# EAGLE design dcdc_0501 (EAGLE 9.6.2)
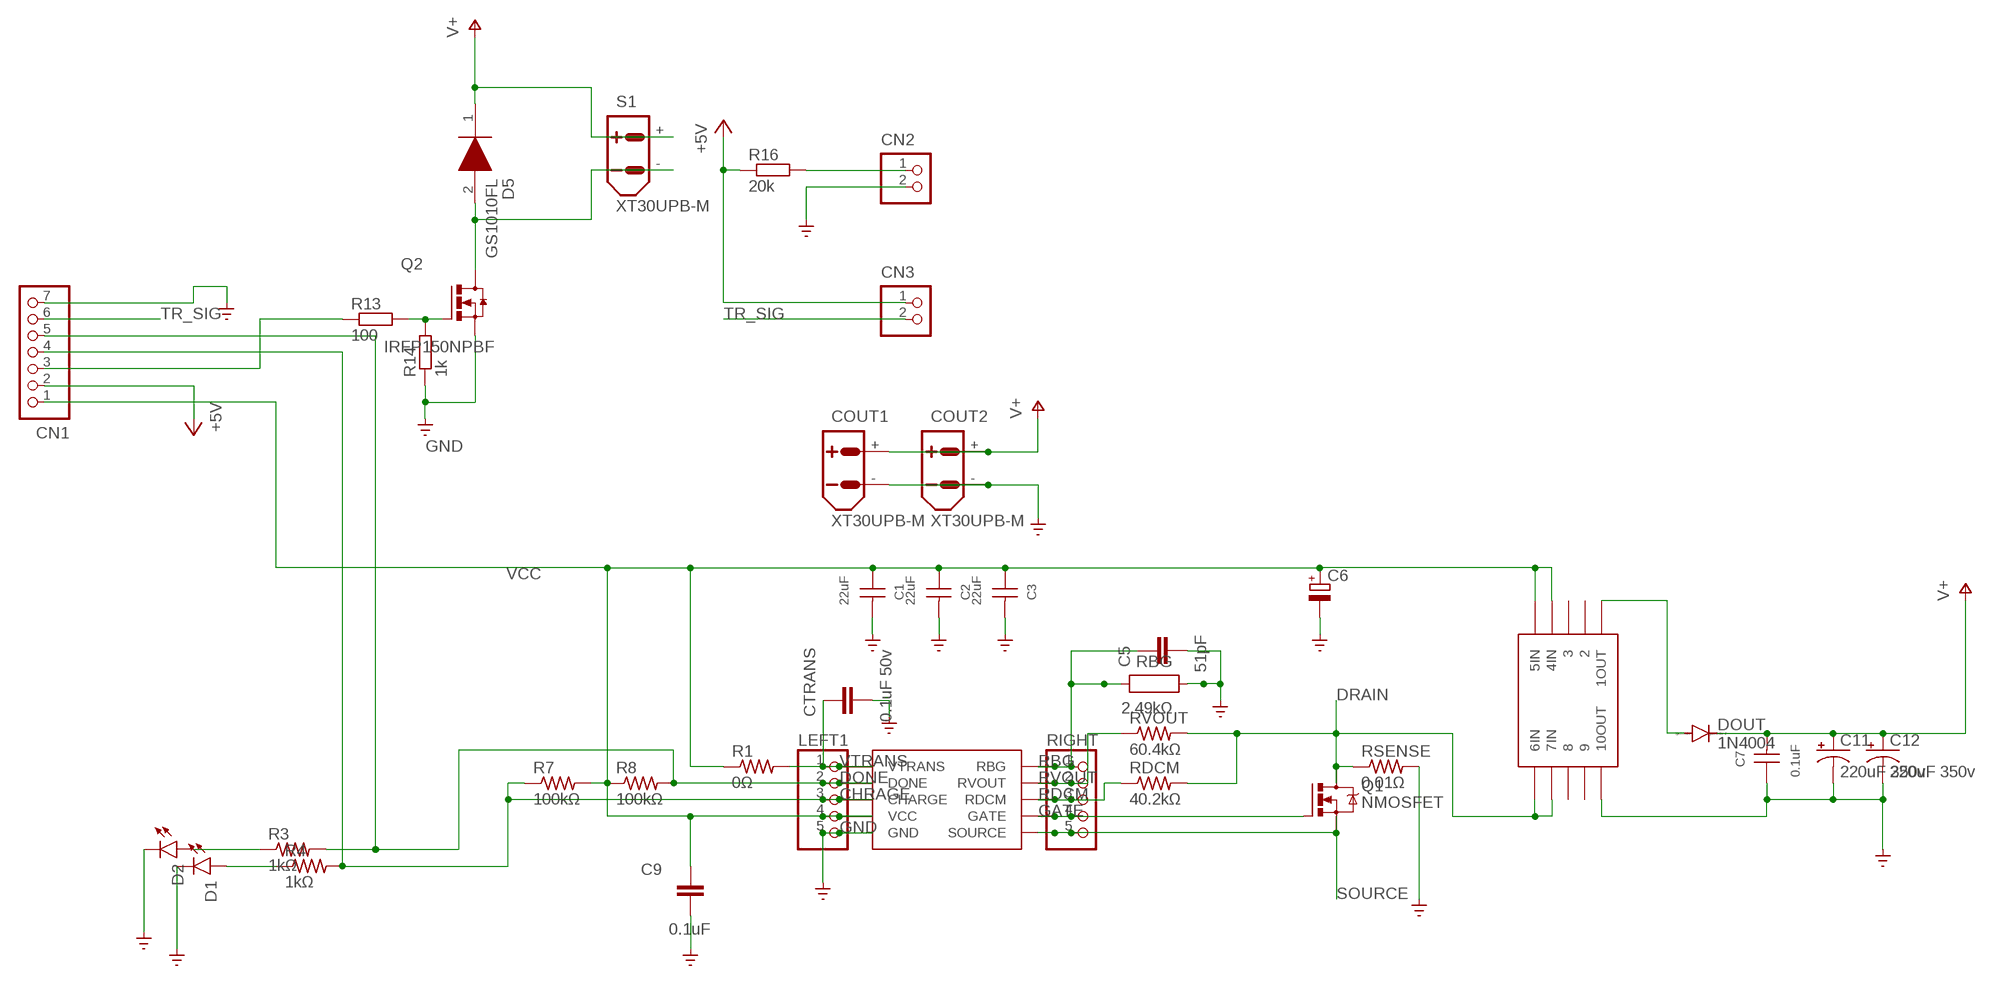
[diagram p0: schematic, sheet 1]

## Parts
C1  22uF  WCAP-CSGP_1210_H0.95_885012009002_25V(DC)  [WCAP-CSGP_1210_H0.95]
C2  22uF  WCAP-CSGP_1210_H0.95_885012009002_25V(DC)  [WCAP-CSGP_1210_H0.95]
C3  22uF  WCAP-CSGP_1210_H0.95_885012009002_25V(DC)  [WCAP-CSGP_1210_H0.95]
C5  51pF  C0603C100C5GACTU  [CAP_0603]
C6  CPOL-EUTT2D6  [TT2D6]
C7  0.1uF  WCAP-CSGP_1812_H1.25_885012010001_16V(DC)  [WCAP-CSGP_1812_H1.25]
C9  0.1uF  C0603C100C5GACTU  [CAP_0603]
C11  220uF 350v  CAPACITOR-PE7.5-18  [E7,5-18]
C12  220uF 350v  CAPACITOR-PE7.5-18  [E7,5-18]
CN1  B7B-XH-A  [B7B-XH-A]
CN2  B2B-XH-A  [B2B-XH-A]
CN3  B2B-XH-A  [B2B-XH-A]
COUT1  XT30UPB-M  [XT30UPB-M]
COUT2  XT30UPB-M  [XT30UPB-M]
CTRANS  0.1uF 50v  GRM31CR60J107ME39L  [CAP_1206]
D1  LED_RADIALWHITE  [LEDRD254W60D565H860B_W]
D2  LED_RADIALWHITE  [LEDRD254W60D565H860B_W]
D5  GS1010FL  [SODFL3618X110N]
DOUT  1N4004  [DO41-10]
LEFT1  PINHD-1X5  [1X05]
Q1  NMOSFET  NMOSFET__TO220  [TO220BV]
Q2  IRFP150NPBF  [TO-247AC]
R1  0Ω  R-US_M2012  [M2012]
R3  1kΩ  RC0402JR-070RL  [RES_0402]
R4  1kΩ  RC0402JR-070RL  [RES_0402]
R7  100kΩ  R-US_R1210  [R1210]
R8  100kΩ  R-US_R1210  [R1210]
R13  100  R-EU_R0603  [R0603]
R14  1k  R-EU_R0603  [R0603]
R16  20k  R-EU_R0603  [R0603]
RBG  2.49kΩ  WRIS-PSMC_2512_580070763005_6.3X3.1X0.51X1.1  [WRIS_PSMC_2512_6.3X3.1X0.51X1.1(LXWXHXPW)]
RDCM  40.2kΩ  CRCW08050000Z0EA  [RES_0805]
RIGHT  PINHD-1X5  [1X05]
RSENSE  0.01Ω  WSLP1206R0500FEA  [RES_1206]
RVOUT  60.4kΩ  CRCW08050000Z0EA  [RES_0805]
S1  XT30UPB-M  [XT30UPB-M]
U$1  LT3750_2  [LT3750_2]
U$2  32052  [32052]

## Nets
2 [New Class]: D5.2(A) Q2.D S1.-
+5V [New Class]: CN1.2 CN3.1 R16.1
CHRAGE: CN1.4 LEFT1.3 R4.2 R7.1 U$1.CHARGE
DONE: CN1.5 LEFT1.2 R3.2 R8.2 U$1.DONE
DRAIN [New Class]: Q1.D RDCM.2 RSENSE.1 RVOUT.2 U$2.6IN U$2.7IN
GATE: Q1.G RIGHT.4 U$1.GATE
GND: C1.2 C2.2 C3.2 C5.2 C6.- C7.1 C9.2 C11.- C12.- CN1.7 CN2.2 COUT1.- COUT2.- CTRANS.2 D1.C D2.C LEFT1.5 Q2.S R14.1 RBG.2 RSENSE.2 U$1.GND U$2.10OUT ; supply symbol labelled SUPPLY0_GND_
N$1 [New Class]: CN1.3 R13.1
N$7 [New Class]: DOUT.A U$2.1OUT
N$11 [New Class]: D1.A R4.1
N$15 [New Class]: D2.A R3.1
N$21 [New Class]: Q2.G R13.2 R14.2
N$22 [New Class]: CN2.1 R16.2
RBG: C5.1 RBG.1 RIGHT.1 U$1.RBG
RDCM: RDCM.1 RIGHT.3 U$1.RDCM
RVOUT: RIGHT.2 RVOUT.1 U$1.RVOUT
SOURCE: Q1.S RIGHT.5 U$1.SOURCE
TR_SIG [New Class]: CN1.6 CN3.2
V+ [New Class]: C7.2 C11.+ C12.+ COUT1.+ COUT2.+ D5.1(K) DOUT.C S1.+
VCC: C1.1 C2.1 C3.1 C6.+ C9.1 CN1.1 LEFT1.4 R1.1 R7.2 R8.1 U$1.VCC U$2.4IN U$2.5IN
VTRANS: CTRANS.1 LEFT1.1 R1.2 U$1.VTRANS
Unconnected: U$2.2 U$2.3 U$2.8 U$2.9

## Library data of the parts
C1-C3 = Wurth_Capacitors_WCAP-CSGP:WCAP-CSGP_1210_H0.95: WCAP-CSGP MLCCs 1210 Characteristics General purpose product series High performance ceramic High electrical precision and stability ceramic especially for NP0 Minimal aging especially for NP0 Mounting style: SMT-Chip Ceramic: NP0 (Class I), X5R (Class II), X7R (Class II) Temperature coefficient: ±30 ppm/°C; ±0.54 % for NP0 ±15 % for X5R and X7R Operating temperature: -55 °C up to + 125 °C for NP0 and X7R -55 °C up to + 85 °C for X5R Termination: Cu/Ni/Sn Recommended soldering: Reflow soldering Wave soldering for size 0603 Wave soldering for size 0805 (only valid for the thickness ≤0.85 mm) Applications Temperature compensation (NP0) Coupling Decoupling Bypass Smoothing Filtering Resonant circuit <https://www.we-online.com/catalog/media/o177837v209%20MLCC_GRP_all.jpg> Details see: https://www.we-online.com/catalog/en/pbs/capacitors/multilayer_ceramic_chip_capacitors/mlcc_general_purpose Updated by yingchun,Shan;2020-03-09 2020(C) Würth Elektronik; CERAMIC-TYPE: NP0 Class I; DATASHEET-URL: https://www.we-online.com/redexpert/spec/885012009002?ae; DF: -; HEIGHT: 0.95mm; MOUNT: SMT; OPERATING-TEMPERATURE: -55 up to +125 °C; PART-NUMBER: 885012009002; QMIN: 1000; RISO: 10GOhm; SIZE: 1210; TECHNICAL-REFERENCE: NP01210102J025DFCT10000; VALUE: 1nF; VR: 25V(DC)
C5 C9 = Resistor_Capacitor:C0603C100C5GACTU: CAP CER 10PF 50V C0G/NP0 0603 Manufacturer's datasheet <https://content.kemet.com/datasheets/KEM_C1003_C0G_SMD.pdf>; CREATED_BY: PCBLayout.com; DIGIKEY_PART_NUMBER: 399-7814-2-ND; MANUFACTURER: KEMET; MPN: C0603C100C5GACTU; PACKAGE: SMD 0603
C6 = rcl:CPOL-EU: POLARIZED CAPACITOR, European symbol; SPICEPREFIX: C
C7 = Wurth_Capacitors_WCAP-CSGP:WCAP-CSGP_1812_H1.25: WCAP-CSGP MLCCs 1812 Characteristics General purpose product series High performance ceramic High electrical precision and stability ceramic especially for NP0 Minimal aging especially for NP0 Mounting style: SMT-Chip Ceramic: NP0 (Class I), X5R (Class II), X7R (Class II) Temperature coefficient: ±30 ppm/°C; ±0.54 % for NP0 ±15 % for X5R and X7R Operating temperature: -55 °C up to + 125 °C for NP0 and X7R -55 °C up to + 85 °C for X5R Termination: Cu/Ni/Sn Recommended soldering: Reflow soldering Wave soldering for size 0603 Wave soldering for size 0805 (only valid for the thickness ≤0.85 mm) Applications Temperature compensation (NP0) Coupling Decoupling Bypass Smoothing Filtering Resonant circuit <https://www.we-online.com/catalog/media/o177837v209%20MLCC_GRP_all.jpg> Details see: https://www.we-online.com/catalog/en/pbs/capacitors/multilayer_ceramic_chip_capacitors/mlcc_general_purpose Updated by yingchun,Shan;2020-03-09 2020(C) Würth Elektronik; CERAMIC-TYPE: NP0 Class I; DATASHEET-URL: https://www.we-online.com/redexpert/spec/885012010001?ae; DF: -; HEIGHT: 1.25mm; MOUNT: SMT; OPERATING-TEMPERATURE: -55 up to +125 °C; PART-NUMBER: 885012010001; QMIN: 1000; RISO: 10GOhm; SIZE: 1812; TECHNICAL-REFERENCE: NP01812102J016DFCT10000; VALUE: 1nF; VR: 16V(DC)
C11 C12 = BeagleBone_Blue_R3:CAPACITOR-P: POLARIZED CAPACITOR, American symbol
CN1 = jst-xh:B7B-XH-A: Wire-to-Board 2.5mm pitch top mount connector Source: http://www.jst-mfg.com/product/pdf/jpn/XH.pdf http://www.jst-mfg.com/product/detail.php?series=277
CN2 CN3 = jst-xh:B2B-XH-A: Wire-to-Board 2.5mm pitch top mount connector Source: http://www.jst-mfg.com/product/pdf/jpn/XH.pdf http://www.jst-mfg.com/product/detail.php?series=277
COUT1 COUT2 S1 = amass:XT30: AMASS XT30 connector Store in Japan AMASS XT30 connector <https://szc.jp/ams-xt30>
CTRANS = Resistor_Capacitor:GRM31CR60J107ME39L: CAP CER 100UF 6.3V X5R 1206 Manufacturer's datasheet <https://www.murata.com/~/media/webrenewal/support/library/catalog/products/capacitor/mlcc/c02e.ashx?la=en-us>; CREATED_BY: PCBLayout.com; DIGIKEY_PART_NUMBER: GRM31CR60J107ME39L; MANUFACTURER: Murata Electronics North America; MPN: GRM31CR60J107ME39L; PACKAGE: SMD 1206
D1 D2 = Opto-Electronic:LED_RADIAL: LED - Generic
D5 = GS1010FL:GS1010FL: Surface general purpose rectifier Source: Datasheet; DESCRIPTION: Surface general purpose rectifier; HEIGHT: 1.1mm; MANUFACTURER_NAME: PANJIT; MANUFACTURER_PART_NUMBER: GS1010FL
DOUT = diode:1N4004: DIODE general purpose rectifier, 1 A
LEFT1 RIGHT = Connector:PINHD-1X5: PIN HEADER; CATEGORY: CONNECTOR; SUB-CATEGORY: PIN-HEADER
Q1 = Tinkercad:NMOSFET: N-Channel MOSFET - Generic; CATEGORY: Transistor; SUB-CATEGORY: MOSFET; TYPE: N-Channel
Q2 = Transistor:IRFP150NPBF: MOSFET N-CH 100V 42A TO247AC Manufacturer's datasheet <https://www.infineon.com/dgdl/irfp150npbf.pdf?fileId=5546d462533600a4015356286d121fd6>; CREATED_BY: PCBLayout.com; DIGIKEY_PART_NUMBER: IRFP150NPBF-ND; MANUFATURER: Infineon Technologies; MPN: IRFP150NPBF; PACKAGE: TO-247AC
R1 R7 R8 = BeagleBone_Black_Wireless:R-US_: RESISTOR, American symbol
R3 R4 = Resistor_Capacitor:RC0402JR-070RL: RES SMD 0 OHM JUMPER 1/16W 0402 Manufacturer's datasheet <http://www.yageo.com/documents/recent/PYu-RC_Group_51_RoHS_L_10.pdf>; CREATED_BY: PCBLayout.com; DIGIKEY_PART_NUMBER: 311-0.0JRTR-ND; MANUFACTURER: Yageo; MPN: RC0402JR-070RL; PACKAGE: SMD 0402
R13 R14 R16 = rcl:R-EU_: RESISTOR, European symbol; SPICEPREFIX: R
RBG = Wurth_Resistor_WRIS-PSMC:WRIS-PSMC_2512: WRIS-PSMC Metal Plate Resistors High Power Current Sensing Characteristics Product series for high power current sensing up to 2 W Mounting style: SMT-Chip (standard terminal) Resistance range: 2 mΩ ‒ 10 mΩ Resistance tolerance: ±1%; ±5% Rated Power: 2 W TCR: ±100 ppm/°C Operating temperature: -55°C up to +155°C Size: 2512 Recommended soldering: Reflow soldering Applications Ignition coil & igniter Motor control Inverter Battery pack Package name and Variant abbreviation: L X W X H X PW =Length X Width X Height X Pad Width <https://katalog.we-online.com/media/images/v2/o135744v209%20Family_WRIS-PSMC.jpg> Details see: https://katalog.we-online.com/en/pbs/WRIS-PSMC Created by Ella Wu 2019-09-05 2019(C) Wurth Elektronik; DATASHEET-URL: https://katalog.we-online.de/pbs/datasheet/580070763005.pdf; IR: 20A; MOUNT: SMT; PART-NUMBER: 580070763005; PRATED: 2W; TCR: ±100ppm/ °C; TECHNICAL-REFERENCE: MC2512R005F201KAATE0000; VALUE: 5mOhm
RDCM RVOUT = Resistor_Capacitor:CRCW08050000Z0EA: RES SMD 0 OHM JUMPER 1/8W 0805 Manufacturer's datasheet <http://www.vishay.com/docs/20035/dcrcwe3.pdf>; CREATED_BY: PCBLayout.com; DIGIKEY_PART_NUMBER: 541-0.0ATR-ND; MANUFACTURER: Vishay Dale; MPN: CRCW08050000Z0EA; PACKAGE: SMD 0805
RSENSE = Resistor_Capacitor:WSLP1206R0500FEA: RES 0.05 OHM 1% 1W 1206 Manufacturer's datasheet <http://www.vishay.com/docs/30122/wslp.pdf>; CREATED_BY: PCBLayout.com; DIGIKEY_PART_NUMBER: WSLP-.05TR-ND; MANUFACTURER: Vishay Dale; MPN: WSLP1206R0500FEA; PACKAGE: SMD 1206
U$1 = boostTest1215:LT3750_2
U$2 = boostTest1215:32052

## Net classes
0 default: width 0.2 mm, drill 0.1 mm
1 New Class: width 1.2 mm, clearance 0.203 mm

## Board
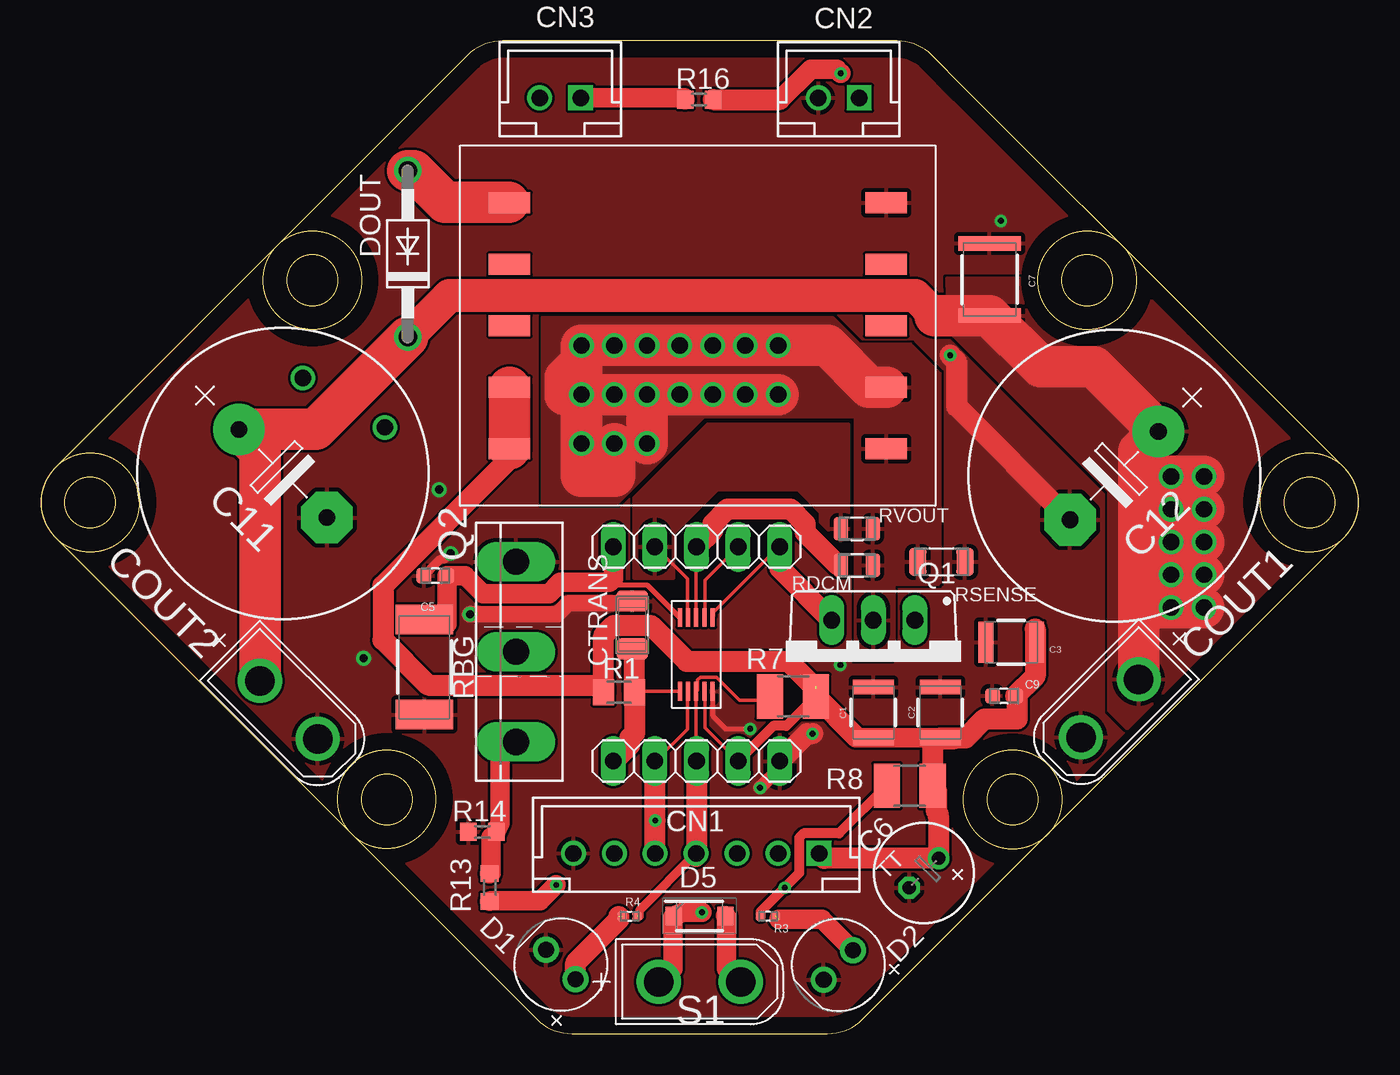
[diagram p1: board, top side]
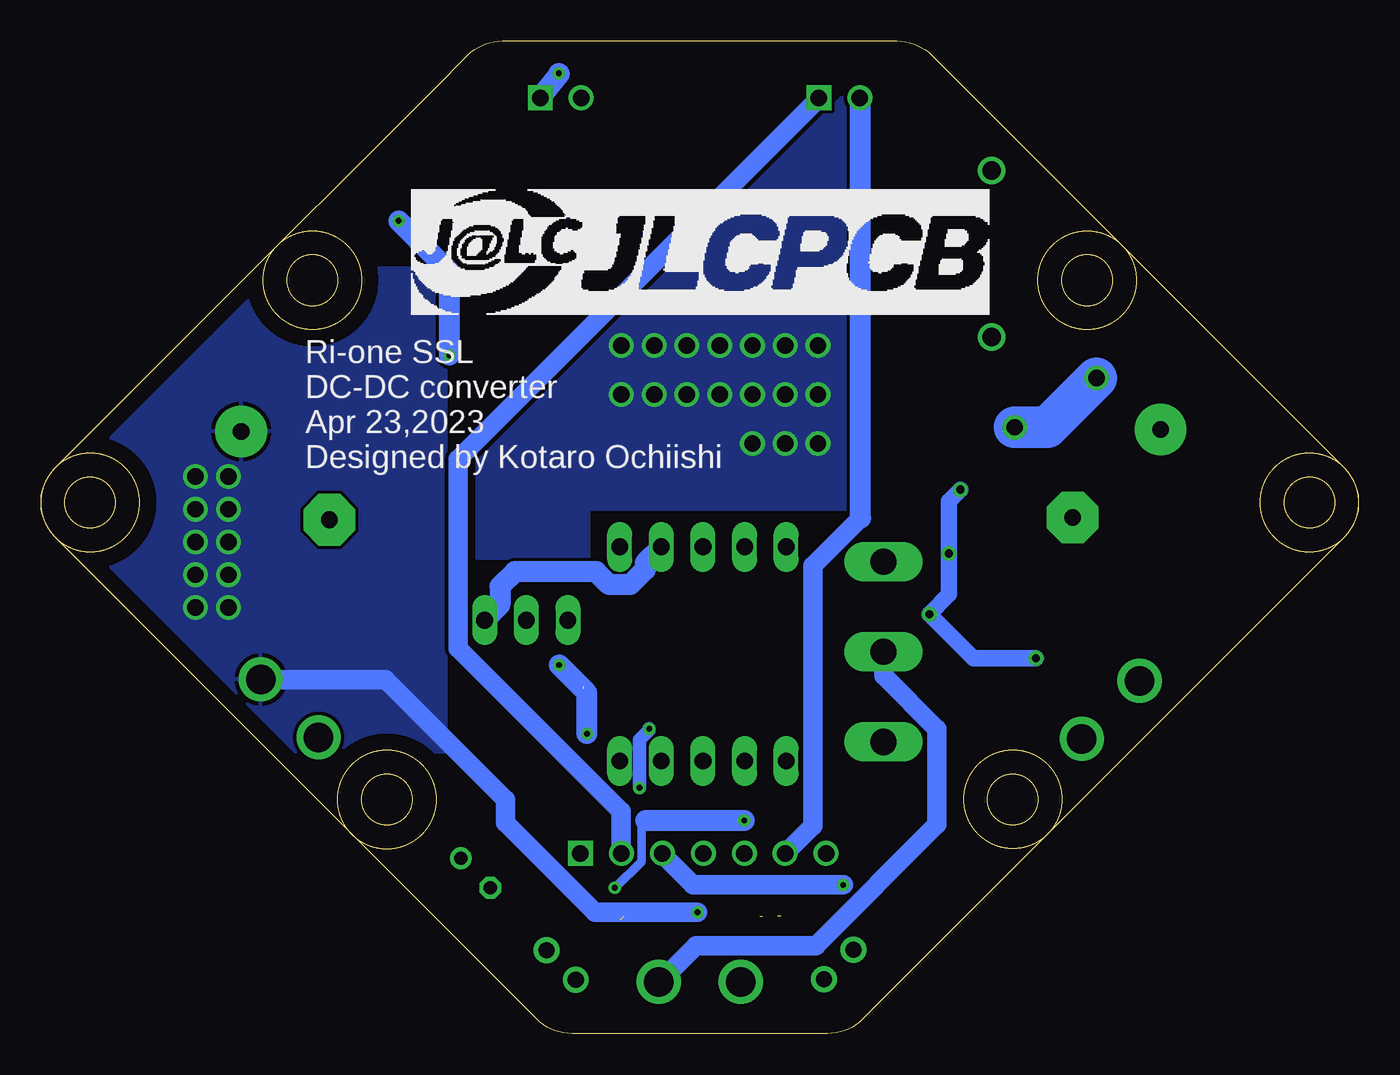
[diagram p2: board, bottom side, seen from below]

Size 80.43 x 60.58 mm. Coordinates in mm from the lower left corner, seen from the top.
Outline: 0.88,34.53 arc90 0.88,30.29
Outline: 30.29,0.88 arc45 32.41,0
Outline: 48.03,0 arc45 50.15,0.88
Outline: 79.56,30.29 arc90 79.56,34.53
Outline: 54.39,59.7 arc45 52.27,60.58
Outline: 28.17,60.58 arc45 26.05,59.7
Outline: 0.88,34.53 arc90 0.88,30.29
Outline: 0.88,30.29 17,14.16 30.29,0.88
Outline: 30.29,0.88 arc45 32.41,0
Outline: 32.41,0 48.03,0
Outline: 48.03,0 arc45 50.15,0.88
Outline: 50.15,0.88 63.43,14.16 79.56,30.29
Outline: 79.56,30.29 arc90 79.56,34.53
Outline: 79.56,34.53 70.67,43.41 56.39,57.7 54.39,59.7
Outline: 54.39,59.7 arc45 52.27,60.58
Outline: 52.27,60.58 28.17,60.58
Outline: 28.17,60.58 arc45 26.05,59.7
Outline: 26.05,59.7 0.88,34.53
Outline: circle at 3,32.41 radius 1.55
Outline: circle at 16.57,45.97 radius 3
Outline: circle at 3,32.41 radius 3
Outline: circle at 16.57,45.97 radius 1.55
Outline: circle at 21.12,14.29 radius 1.55
Outline: circle at 77.43,32.41 radius 1.55
Outline: circle at 59.32,14.29 radius 3
Outline: circle at 63.87,45.97 radius 3
Outline: circle at 77.43,32.41 radius 3
Outline: circle at 63.87,45.97 radius 1.55
Outline: circle at 59.32,14.29 radius 1.55
Outline: circle at 3,32.41 radius 1.55
Outline: circle at 16.57,45.97 radius 3
Outline: circle at 3,32.41 radius 3
Outline: circle at 16.57,45.97 radius 1.55
Outline: circle at 21.12,14.29 radius 1.55
Outline: circle at 77.43,32.41 radius 1.55
Outline: circle at 59.32,14.29 radius 3
Outline: circle at 63.87,45.97 radius 3
Outline: circle at 77.43,32.41 radius 3
Copper layers (1*16): Top 0.035mm / dielectric 1.5mm / Bottom 0.035mm
Design rules "default": minimum track width 6mil, minimum drill 0.35mm, track to track 6mil, track to pad 6mil, pad to pad 6mil, via to via 6mil, smd to smd 6mil, copper to edge 40mil, drill to drill 6mil, minimum pad ring 10mil, minimum via ring 8mil, stop-mask expansion 4mil, vias tented up to drill 0mil, thermal gap 10mil

### Footprints (pad centres in the part's own frame; a part is rotated, then mirrored left to right if it is on the bottom)
WCAP-CSGP_1210_H0.95 = smd 0.9 x 2.5: 1 -1.55,0; 2 1.55,0
CAP_0603 = smd 0.92 x 0.93: 1 -0.705,0; 2 0.705,0
TT2D6 = drill 0.813: + -1.27,0 | drill 0.813 octagon: - 1.27,0
WCAP-CSGP_1812_H1.25 = smd 0.9 x 3.8: 1 -2.2,0; 2 2.2,0
E7,5-18 = drill 1.016 pad 3.15: + -3.81,0 | drill 1.016 pad 3.15 octagon: - 3.81,0
B7B-XH-A = drill 1.016 square: 1 -7.5,0 | drill 1.016: 2 -5,0; 3 -2.5,0; 4 0,0; 5 2.5,0; 6 5,0; 7 7.5,0
B2B-XH-A = drill 1.016 square: 1 -1.25,0 | drill 1.016: 2 1.25,0
XT30UPB-M = drill 1.8: + 2.5,0; - -2.5,0
CAP_1206 = smd 1.29 x 1.91: 1 -1.46,0; 2 1.46,0
LEDRD254W60D565H860B_W = drill 0.981 pad 1.581: A -1.27,0; C 1.27,0
SODFL3618X110N = smd 1 x 1.13: 1 -1.575,0; 2 1.575,0
DO41-10 = drill 1.118: A 5.08,0; C -5.08,0
1X05 = drill 1.016 long: 1 -5.08,0; 2 -2.54,0; 3 0,0; 4 2.54,0; 5 5.08,0
TO220BV = drill 1.016 long: D 0,-2.54; G -2.54,-2.54; S 2.54,-2.54
TO-247AC = drill 1.6 long: D 0,0; G -5.5,0; S 5.5,0
M2012 = smd 1.3 x 1.6: 1 -0.95,0; 2 0.95,0
RES_0402 = smd 0.58 x 0.58: 1 -0.46,0; 2 0.46,0
R1210 = smd 1.6 x 2.7: 1 -1.4,0; 2 1.4,0
R0603 = smd 1 x 1.1: 1 -0.85,0; 2 0.85,0
WRIS_PSMC_2512_6.3X3.1X0.51X1.1(LXWXHXPW) = smd 1.8 x 3.5: 1 -2.9,0; 2 2.9,0
RES_0805 = smd 0.87 x 1.42: 1 -0.975,0; 2 0.975,0
RES_1206 = smd 1.08 x 1.68: 1 -1.445,0; 2 1.445,0
LT3750_2 = smd 1.15 x 0.25: CHARGE 0.5,1.5; DONE 0.5,2; GATE 5,1; GND 0.5,0.5; RBG 5,2.5; RDCM 5,1.5; RVOUT 5,2; SOURCE 5,0.5; VCC 0.5,1; VTRANS 0.5,2.5
32052 = smd 2.54 x 1.27: 1OUT 3,18.5; 2 3,14.75; 3 3,11; 4IN 3,7.25; 5IN 3,3.5; 6IN 26,3.5; 7IN 26,7.25; 8 26,11; 9 26,14.75; 10OUT 26,18.5

### Placement (x,y rotation side)
C1  50.81,19.6 90 top
C2  54.9,19.6 90 top
C3  59.23,23.89 180 top
C5  24.08,27.94 180 top
C6  53.9,9.8 225 top
C7  57.91,46.02 270 top
C9  58.79,20.61 180 top
C11  14.77,34.18 315 top
C12  65.52,34.05 225 top
CN1  40,11 180 top
CN2  48.7,57.1 180 top
CN3  31.7,57.1 180 top
COUT1  65.25,19.85 45 top
COUT2  15.13,19.76 135 top
CTRANS  36.1,24.94 90 top
D1  31.74,4.21 135 top
D2  48.68,4.19 225 top
D5  40.21,7.18 0 top
DOUT  22.39,47.59 90 top
LEFT1  40.02,16.63 0 top
Q1  50.81,22.69 180 top
Q2  29,23.3 90 top
R1  35.29,20.84 0 top
R3  44.39,7.16 180 top
R4  35.94,7.16 0 top
R7  45.91,20.58 0 top
R8  53.04,15.13 180 top
R13  27.4,8.92 90 top
R14  26.94,12.31 0 top
R16  40.18,57 0 top
RBG  23.41,22.36 270 top
RDCM  49.82,28.57 0 top
RIGHT  40.02,29.71 0 top
RSENSE  54.97,28.79 0 top
RVOUT  49.82,30.81 0 top
S1  40.22,3.16 180 top
U$1  41.5,20.39 90 top
U$2  25.6,32.2 0 top

### Tracks (layer width: path | path; a pad name or v marks a point on that pad's centre or on a via)
2
  Top 1.2: D5.2 41.85,7.14 41.85,3.96 42.64,3.17 S1.-
  Bottom 1.2: Q2.D 28.98,23.26 28.98,21.85 25.73,18.59 25.73,12.77 33.13,5.37 40.44,5.37 42.64,3.17 S1.-
+5V
  Top 1.2: 39.3,57.1 R16.1 | 39.3,57.1 CN3.1 | 39.3,57.1
  Bottom 1.2: CN3.1 33.16,56.89 33.16,56.86 54.97,35.05 54.97,23.52 45.02,13.57 45.02,11.01 CN1.2
CHRAGE  (1 unrouted)
  Top 0.2: 40,10.92 CN1.4 40,11.01 | LEFT1.3 40,16.65 U$1.CHARGE 40.09,20.97 40.09,21.58 40.26,21.76 41.23,21.76 42.64,20.35 44.45,20.35 R7.1
  Top 0.508: CN1.4 36.54,7.54 36.54,7.16
  Top 1.2: 40,10.76 40,10.92
  Top 1.27: LEFT1.3 40.02,11.04 40,11.01
DONE  (via drill 0.35)
  Top 0.2: U$1.DONE 39.47,20.88 39.47,18.59 37.53,16.65 LEFT1.2 | R3.2 43.93,7.19 43.96,7.22 43.96,7.19 R3.2
  Top 0.508: v45.4,8.9 43.93,7.43 R3.2
  Top 0.61: R8.2 48.73,12.22 46.55,12.22 46.28,11.95 46.28,9.8 43.93,7.45 R3.2
  Top 1.27: CN1.5 v37.5,13 37.5,16.62 37.53,16.65
  Bottom 0.508: 43.5,13 43.78,12.72 43.78,10.49 45.38,8.9 v45.4,8.9
  Bottom 1.27: v37.5,13 43.5,13
DRAIN  (via drill 1)
  Top 2.54: U$2.7IN 50.55,39.45 48,42 v45,42 v43,42 v41,42 v39,42 v37,42 v35,42 v33,42 33,41 | 33,41 32,40 32,39 v33,39 | v33,39 v35,39 v37,39 | v37,39 v39,39 v41,39 v43,39 v45,39 | 33,41 v33,39 | v33,39 v33,36 33,34 35,34 v35,36 | v37,39 v37,36
  pour Bottom: 31.2,57.1 31.2,32 47,32 47,29 53.8,29 53.8,34.9 31.6,57.1
  pour Top: 30.6,43.8 30.6,32.3 35.2,32.3 40.5,37.6 49.7,37.6 49.7,22.8 51.9,22.8 52.1,23 52.1,27.4 54.8,27.4 54.9,27.5 54.9,40.3 53.1,42.1 50,42.1 48.3,43.8
GATE
  Top 0.2: U$1.GATE 40.53,25.46 40.53,27.66 42.55,29.69 RIGHT.4
  Bottom 1.27: RIGHT.4 43.55,28.72 43.55,28.31 44.46,27.4 45.74,27.4 46.54,28.2 51.5,28.2 52.41,27.29 52.41,26.17 Q1.G
GND  (via drill 0.35, 0.5)
  Top 0.2: 23.43,28.02 C5.2
  Top 0.305: U$1.GND 41,19.4 41.8,18.6 v43.3,18.6
  Top 0.508: v25,29.3 24.65,28.95 24.37,28.95 23.78,28.36 23.78,28.34 C5.2
  Top 0.813: v43.9,15 45.1,16.2 LEFT1.5
  Top 1.016: CTRANS.2 35.37,26.4 35.24,26.27 32.22,26.27 31.53,25.59 26.47,25.59 26.46,25.6 v26.2,25.6
  Top 1.27: LEFT1.5 46.77,18.3 v47.1,18.3 | C12.- 55.9,38.28 55.9,41 v55.5,41.4
  Bottom 0.813: v43.3,18.6 43.3,18.52 43.88,17.94 43.88,15.02 v43.9,15
  Bottom 1.016: v24.3,33.2 25,32.5 v25,29.3 25,26.8 v26.2,25.6 23.5,22.9 v19.7,22.9
  Bottom 1.27: v55.5,41.4 55.5,46.5 v58.6,49.6 | v47.1,18.3 47.1,20.8 v48.8,22.5
  pour Top (rank 4): -0.9,61.3 -0.9,-1.3 84,-1.3 84,61.3
N$1  (via drill 0.35)
  Top 1.2: v31.45,9.07 30.48,8.11 27.49,8.11 R13.1
  Bottom 1.2: v31.45,9.07 40.61,9.07 42.46,10.92 CN1.3
N$4  (via drill 1)
  Bottom 2.54: v21,37 19,37 v16,40
N$7
  Top 1.2: 24.67,50.75 22.89,52.53 DOUT.A | 28.54,50.75 U$2.1OUT
  Top 2.54: DOUT.A 22.74,52.67 24.67,50.75 28.54,50.75
N$11  (1 unrouted)
  Top 1.27: D1.A 32.64,4.32 35.27,6.95 35.27,7.16
N$15  (1 unrouted)
  Top 1.2: D2.A 47.67,6.99 45.04,6.99
N$21
  Top 1.2: R13.2 27.49,9.78 27.49,11.98 27.75,12.25 R14.2 28.02,12.86 28.02,16.83 28.98,17.8 Q2.G
N$22  (via drill 0.35)
  Top 1.2: 45.09,57 45.09,56.95 46.99,58.85 48.6,58.85 48.83,58.62 v48.81,58.6
  Top 1.27: R16.2 45.09,57
  Bottom 1.27: v48.81,58.6 48.78,58.57 CN2.1
RBG
  Top 0.305: U$1.RBG 37.04,27.35 34.9,27.35 34.94,27.39 RIGHT.1
  Top 0.508: RBG.1 24.54,25.26 24.8,25
  Top 1.2: 24.8,25 24.8,27.93 C5.1 25.9,27.94 26.99,26.85 31.01,26.85 31.69,27.53 34.72,27.53 34.94,27.76 RIGHT.1
RDCM
  Top 0.2: U$1.RDCM 40,25.46 40,29.69 RIGHT.3 | 48.6,28.63 48.81,28.63 RDCM.1
  Top 1.27: RIGHT.3 41.01,30.7 41.01,31.11 41.92,32.02 45.74,32.02 46.65,31.11 46.65,30.58 48.6,28.63
RVOUT
  Top 0.2: U$1.RVOUT 39.47,25.46 39.47,27.75 37.53,29.69 RIGHT.2
  pour Top: 36.2,27.8 36.2,32.7 40.7,37.2 49.3,37.2 49.3,30.1 48.7,30.1 47.6,31.2 47.6,31.8 46.2,33.2 41.3,33.2 38.6,30.5 38.6,27.8
SOURCE
  Top 0.2: 44.4,29.07 45.02,29.69 RIGHT.5 44.4,29.07 | 44.4,29.07 41.05,25.73 41.05,25.46 U$1.SOURCE | 44.4,29.07 48.19,25.29 Q1.S
  Top 1.27: Q1.S 45.1,28.4 RIGHT.5
TR_SIG
  Bottom 1.2: 30.39,31.45 33.3,28.54 33.3,12.69 34.98,11.01 CN1.6
  Bottom 1.27: 30.39,31.45 30.39,57.04 CN3.2
V+  (via drill 0.35, 1)
  Top 1.2: 13.39,21.58 COUT2.+ | S1.+ 37.8,3.17 38.59,3.96 38.59,7.14 D5.1 39.2,7.4 v40.35,7.4
  Top 2: 54.59,43.82 53.37,45.04 24.92,45.04 DOUT.C
  Top 2.54: DOUT.C 16.75,36.87 C11.+ 13.39,35.56 13.39,21.58 | COUT1.+ 67.02,24 67.02,26 | 67.02,26 67.02,28 | 67.02,28 67.02,30 | 67.02,30 67.02,32 | 67.02,32 67.02,34 | 67.02,34 67.02,35.55 C12.+ 64.28,40.68 61.05,40.68 C7.2 54.59,43.82 | 67.02,34 v69,34 v71,34 | 67.02,32 v69,32 v71,32 | 67.02,30 v69,30 v71,30 | 67.02,28 v69,28 v71,28 | 67.02,26 v69,26 v71,26
  Bottom 1.2: v40.35,7.4 46.6,7.4 52.07,12.86 52.07,14.27 59.38,21.58 66.96,21.58 COUT1.+
  pour Bottom (rank 2): 55.7,46.7 55.7,17.2 80,17.2 80,46.7
  pour Top: 55.4,42.9 65.2,33.1 65.2,19.7 70.9,14 70.9,13.9 83,26 83,38 74.9,46.1 55.3,46.1
VCC  (1 unrouted)
  Top 0.2: 59.56,20.61 C9.1 59.47,20.53 59.2,20.53 | 60.7,23.88 C3.1 | 50.83,18.06 C1.1 | 54.89,18.06 C2.1 | 54.97,18.06 C2.1 | U$1.VCC 40.53,20.88 40.53,18.68 42.55,16.65 LEFT1.4 | 54.71,14.8 54.45,15.06 R8.1 54.36,15.15 | 54.36,17.97 54.38,17.98 C2.1 | 34.36,21.1 34.36,20.88 R1.1 | 47.31,20.53 47.31,20.35 R7.2 47.33,20.49 47.37,20.3 | 28.54,35.68 U$2.5IN | 50.75,18.06 C1.1 | 49.76,18.05 C1.1
  Top 0.61: LEFT1.4 44.7,18.77 45.5,18.77 R7.2
  Top 1.2: C3.1 60.7,23.97 60.7,24.7 | 47.33,21.02 47.33,20.49 | 49.83,18.06 50.83,18.06 | C1.1 C2.1 | 47.31,21.05 R7.2 | 49.76,18.13 49.76,18.05
  Top 1.27: CN1.1 47.8,10.7 C6.+ 54.8,13.11 54.72,13.54 54.66,13.61 54.66,14.91 R8.1 54.44,17.94 54.5,18 55.7,18 55.67,17.98 54.38,17.98 | 34.36,21.1 34.2,21.26 23.64,21.26 20.87,24.03 20.87,27.34 28.6,35.07 U$2.5IN | R1.1 34.36,20.86 34.36,24.3 34.97,24.91 37.23,24.91 39.43,22.72 45.64,22.72 47.31,21.04 R7.2 49.76,18.13 | 47.15,21.2 47.3,21.2 | C2.1 56.45,18.05 57.6,19.2 59.6,19.2 59.6,20.57 59.56,20.61 | C9.1 60.7,21.82 60.7,24.7
  Top 2.54: U$2.4IN U$2.5IN
  Bottom 0.2: 42.64,16.56 LEFT1.4
VTRANS
  Top 0.2: U$1.VTRANS 38.94,20.88 36.3,20.88 R1.2 | 34.98,16.65 LEFT1.1
  Top 1.27: CTRANS.1 36.24,23.34 R1.2 36.24,18.34 35.93,18.03 35.93,17.61 34.98,16.65

### Text on the board
bNames: Ri-one SSL / DC-DC converter / Apr 23,2023 / Designed by Kotaro Ochiishi